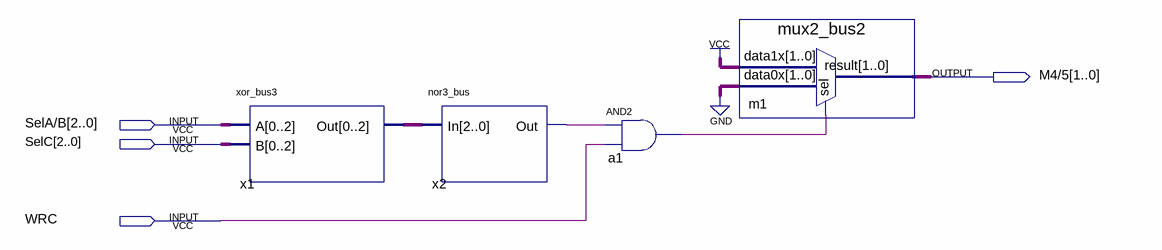
[diagram p0: schematic sheet]
// Quartus schematic op_forwarding2.bdf as structural Verilog: 4 symbols, 4 pins
module op_forwarding2 (
  input  [2:0] \SelA/B ,
  input  [2:0] SelC,
  input  WRC,
  output [1:0] \M4/5 
);

  wire a1_out, x2_out;
  wire [2:0] x1_out;

  xor_bus3 x1 (.A(\SelA/B ), .B(SelC), .Out(x1_out));
  nor3_bus x2 (.In(x1_out), .Out(x2_out));
  and a1 (a1_out, x2_out, WRC);
  mux2_bus2 m1 (.data1x(2'b11), .data0x(2'b00), .sel(a1_out), .result(\M4/5 ));
endmodule
